# Altium schematic sheet dac_audio_out.SchDoc
size A
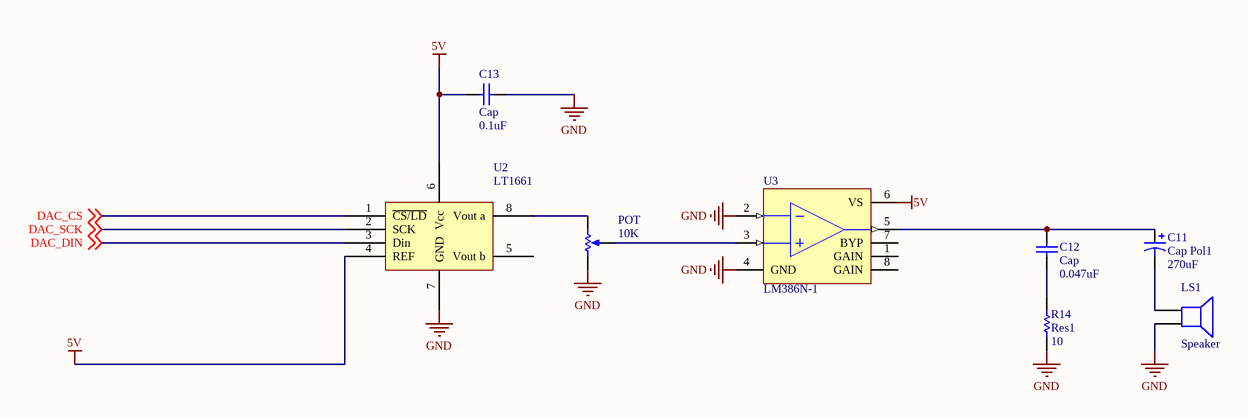
[diagram p0: dac_audio_out.SchDoc]

## Parts
C11  Cap Pol1  value 270uF  [6-0805_M]
C12  Cap  value 0.047uF  [6-0805_M]
C13  Cap  value 0.1uF  [6-0805_M]
LS1  Speaker  [PIN2]
POT  value 10K  [VR5]  (hidden comment: RPot_3)
R14  Res1  value 10  [6-0805_M]
U2  LT1661  [DIP-8]
U3  LM386N-1  [DIP-8]

## Nets
5V: C13.1 U2.4(REF) U2.6(Vcc) U3.6(VS)
GND: C13.2 LS1.2 POT.1(TOP) R14.1 U2.7(GND) U3.2(IN-) U3.4(GND)
DAC_CS: U2.1(~{CS/LD}) ; off-sheet DAC_CS
DAC_DIN: U2.3(Din) ; off-sheet DAC_DIN
DAC_SCK: U2.2(SCK) ; off-sheet DAC_SCK
NetC11_1: C11.1 C12.2 U3.5(OUT)
NetC11_2: C11.2 LS1.1
NetC12_1: C12.1 R14.2
NetPOT_2: POT.2(TAP) U3.3(IN+)
NetPOT_3: POT.3(BOT) U2.8(Vout_a)

Not connected (* = marked no-connect by the designer): U2 5(Vout_b); U3 1(GAIN) 7(BYP) 8(GAIN)

## Library data of the parts
C11 = Cap Pol1: Polarized Capacitor (Radial); Published: 8-Jun-2000; LatestRevisionDate: 17-Jul-2002; LatestRevisionNote: Re-released for DXP Platform.; PackageReference: RB7.6-15; Publisher: Altium Limited; PackageDescription: Polarized Capacitor (Radial); 2 Leads
C12 C13 = Cap: Capacitor; Published: 8-Jun-2000; LatestRevisionDate: 17-Jul-2002; LatestRevisionNote: Re-released for DXP Platform.; PackageReference: RAD-0.3; Publisher: Altium Limited; PackageDescription: Radial Cap, Thru-Hole; 2 Leads; 0.3 in Pin Spacing
LS1 = Speaker: Loudspeaker; Published: 24-Mar-1999; LatestRevisionDate: 17-Jul-2002; LatestRevisionNote: Re-released for DXP Platform.; PackageReference: PIN2; Publisher: Altium Limited
POT = RPot: Potentiometer; Sim Note: Enter the Resistance value and the set point into parameter fields.; Set Position: 0.5; Published: 8-Jun-2000; LatestRevisionDate: 17-Jul-2002; LatestRevisionNote: Re-released for DXP Platform.; Publisher: Altium Limited
R14 = Res1: Resistor; Published: 8-Jun-2000; LatestRevisionDate: 17-Jul-2002; LatestRevisionNote: Re-released for DXP Platform.; PackageReference: AXIAL-0.3; Publisher: Altium Limited; PackageDescription: Axial Device, Thru-Hole; 2 Leads; 0.3 in Pin Spacing
U3 = LM386N-1: Low-Voltage Audio Power Amplifier; Published: 15-Apr-2002; DatasheetDocument: Sep-1997; PackageDocument: Sep-1997; PackageReference: N08E; Publisher: Altium Limited